# Altium schematic sheet Placa_Motor_Esquematico_v2.SchDoc
size A3
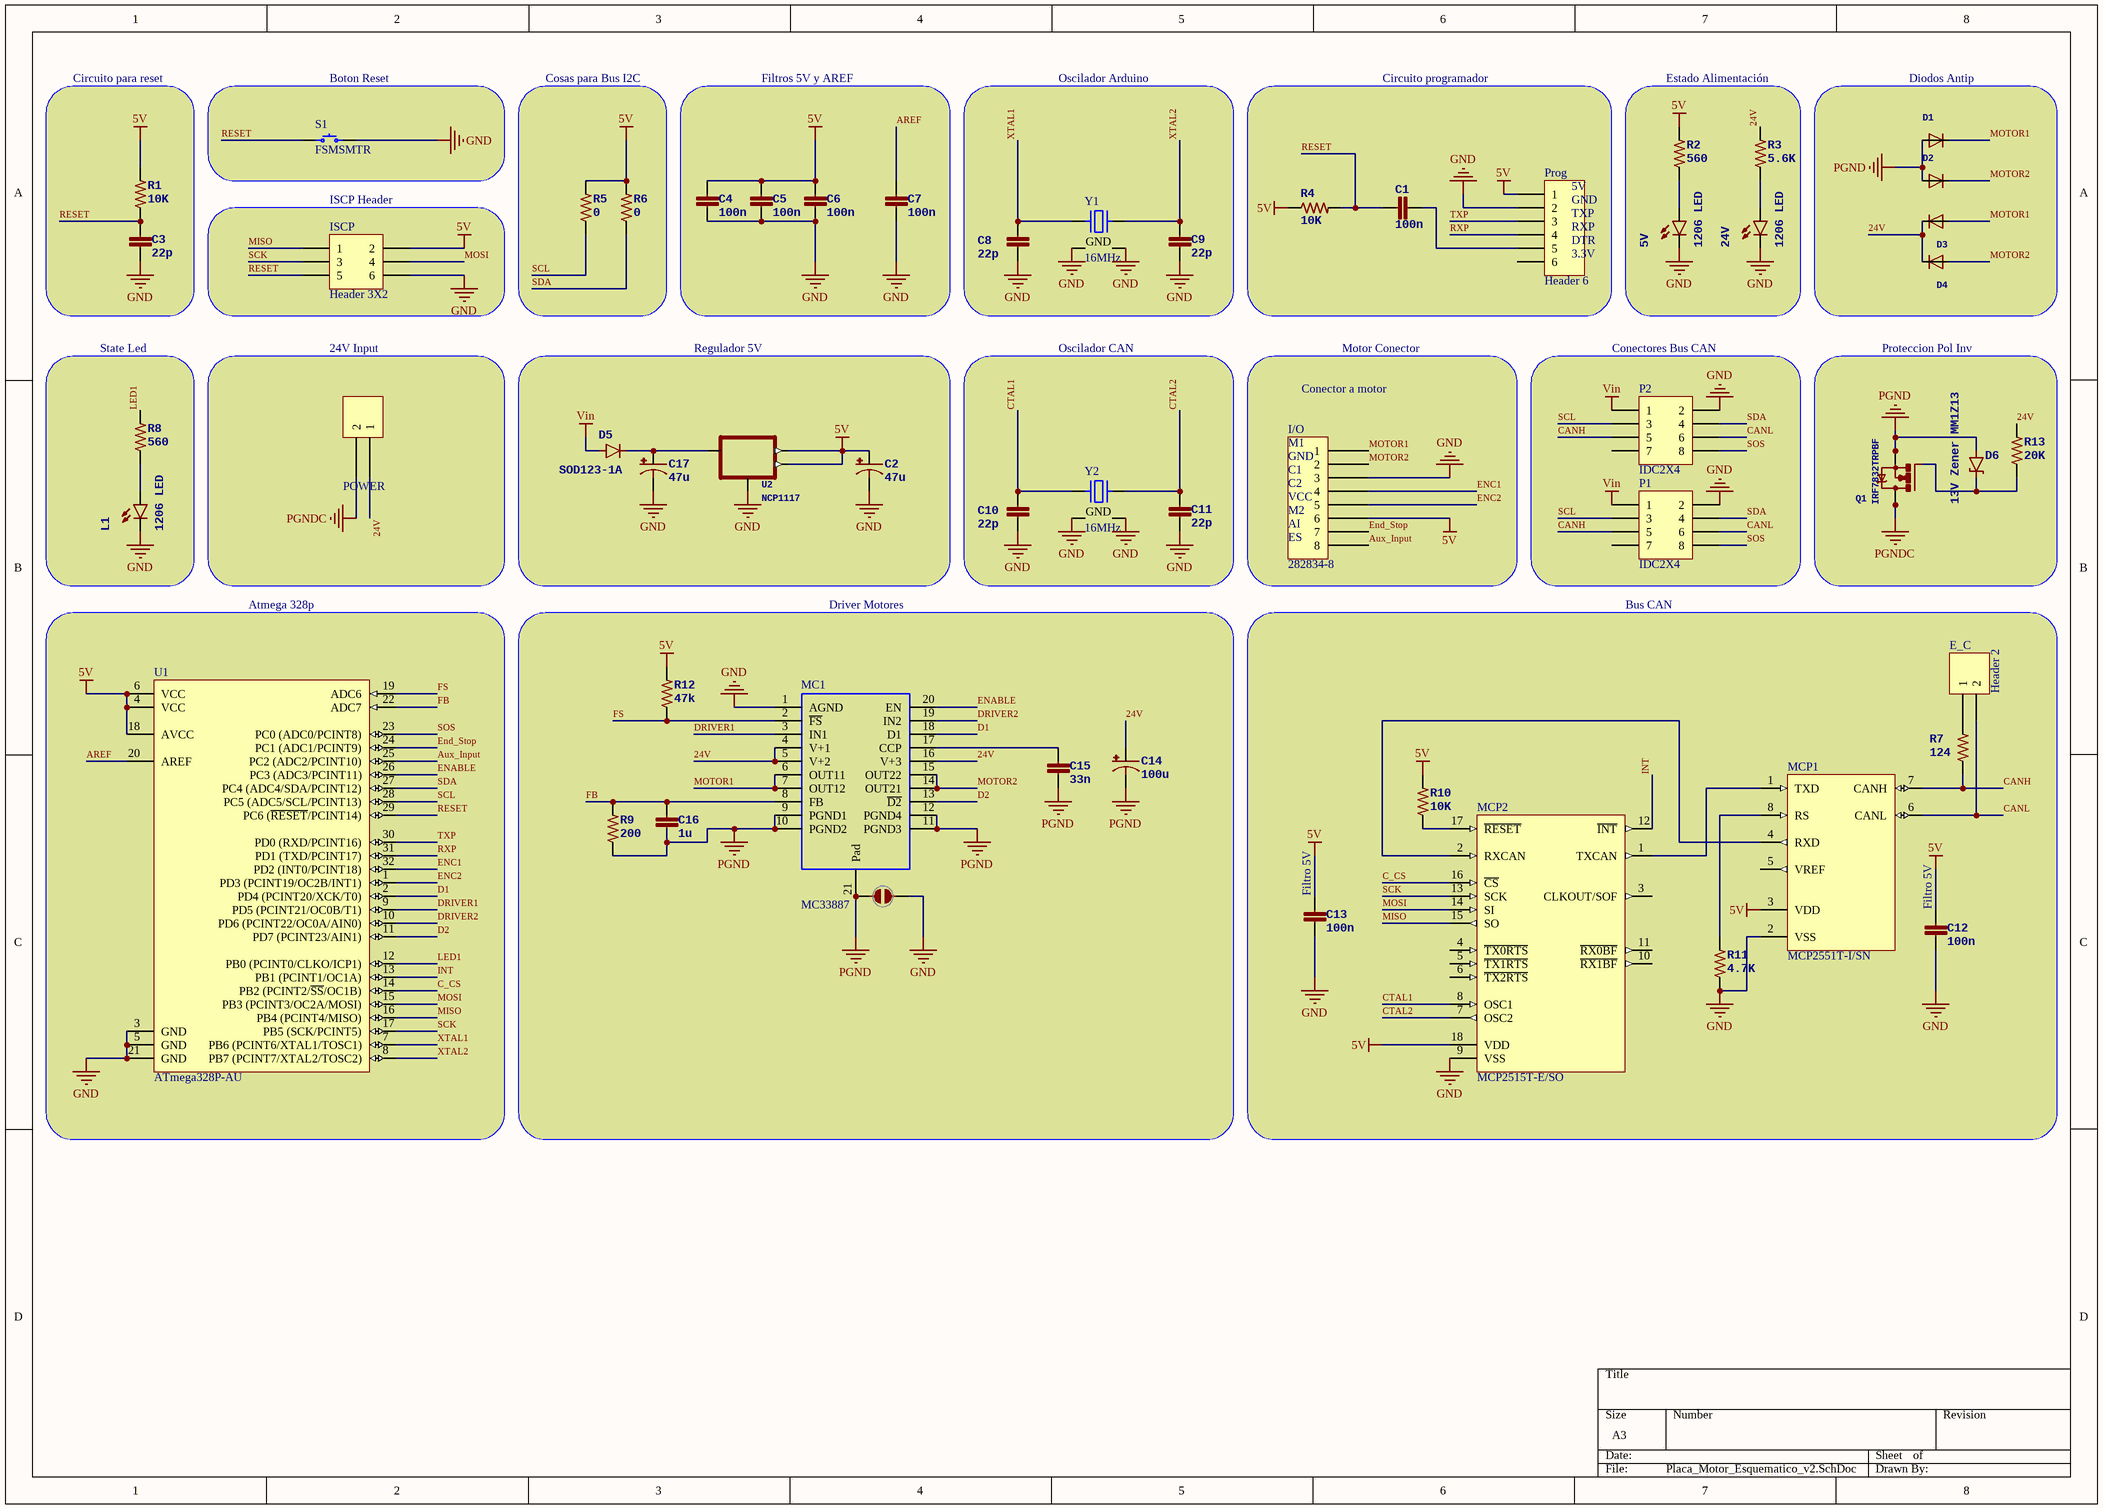
[diagram p0: Placa_Motor_Esquematico_v2.SchDoc]

## Parts
5V  1206 LED  [LED-1206]
24V  1206 LED  [LED-1206]
C1  100n  [0805]
C2  47u  [PANASONIC_D]
C3  22p  [0805]
C4  100n  [0805]
C5  100n  [0805]
C6  100n  [0805]
C7  100n  [0805]
C8  22p  [0805]
C9  22p  [0805]
C10  22p  [0805]
C11  22p  [0805]
C12  100n  [0805]
C13  100n  [0805]
C14  100u  [PANASONIC_D]
C15  33n  [0805]
C16  1u  [0805]
C17  47u  [PANASONIC_D]
D1  SBR3U40P1-7  [POWERDI-123]  (value not drawn)
D2  SBR3U40P1-7  [POWERDI-123]  (value not drawn)
D3  SBR3U40P1-7  [POWERDI-123]  (value not drawn)
D4  SBR3U40P1-7  [POWERDI-123]  (value not drawn)
D5  SOD123-1A  [SOD-123]
D6  13V Zener MM1Z13  [SOD-123]
E_C  Header 2  [HDR1X2]
I/O  282834-8  [TE 282834-8]
ISCP  Header 3X2  [HDR2X3]
JP?  JUMPER-PAD-2-NC_BY_PASTE  [PAD-JUMPER-2-NC_BY_PASTE_YES_SILK]  (value not drawn)
L1  1206 LED  [LED-1206]
MC1  MC33887  [SOIC127P1420X340-21N]
MCP1  MCP2551T-I/SN  [SOIC-SN8_N]
MCP2  MCP2515T-E/SO  [SOIC-SO18_N]
P1  IDC2X4  [IDC2X4]
P2  IDC2X4  [IDC2X4]
POWER  20020110-D021A01LF  [FCI 06-381-2PIN]  (value not drawn)
Prog  Header 6  [HDR1X6]
Q1  IRF7832TRPBF  [SO-08]
R1  10K  [0805]
R2  560  [0805]
R3  5.6K  [0805]
R4  10K  [0805]
R5  0  [0805]
R6  0  [0805]
R7  124  [0805]
R8  560  [0805]
R9  200  [0805]
R10  10K  [0805]
R11  4.7K  [0805]
R12  47k  [0805]
R13  20K  [0805]
S1  FSMSMTR  [TE FSMSMTR]
U1  ATmega328P-AU  [32A_N]
U2  NCP1117  [SOT223]
Y1  16MHz  [NDK NX3225SA]
Y2  16MHz  [NDK NX3225SA]

## Blocks framed on the sheet
Circuito para reset: C3 R1
Boton Reset: S1
Cosas para Bus I2C: R5 R6
Filtros 5V y AREF: C4-C7
Oscilador Arduino: C8 C9 Y1
Estado Alimentación: 5V 24V R2 R3
Diodos Antip: D1-D4
ISCP Header: ISCP
State Led: L1 R8
24V Input: POWER
Regulador 5V: C2 C17 D5 U2
Oscilador CAN: C10 C11 Y2
Conectores Bus CAN: P1 P2
Proteccion Pol Inv: D6 Q1 R13
Atmega 328p: U1
Driver Motores: C14-C16 JP? MC1 R9 R12

## Nets
5V: C2.+ C4.1 C5.1 C6.1 C12.1 C13.1 I/O.6 ISCP.2 MCP1.3(VDD) MCP2.18(VDD) Prog.1 R1.2 R2.2 R4.1 R5.2 R6.2 R10.2 R12.2 U1.4(VCC) U1.6(VCC) U1.18(AVCC) U2.2(OUT) U2.4(OUT@1)
GND: 5V.C 24V.C C2.- C3.2 C4.2 C5.2 C6.2 C7.2 C8.2 C9.2 C10.2 C11.2 C12.2 C13.2 C17.- I/O.3 ISCP.6 JP?.2 L1.C MC1.1(AGND) MCP1.2(VSS) MCP2.9(VSS) P1.2 P2.2 Prog.2 R11.1 S1.2 U1.3(GND) U1.5(GND) U1.21(GND) U2.1(ADJ) Y1.2(GND) Y1.4(GND) Y2.2(GND) Y2.4(GND)
PGND: C14.- C15.2 C16.2 D1.A D2.A D6.A JP?.1 MC1.9(PGND1) MC1.10(PGND2) MC1.11(PGND3) MC1.12(PGND4) MC1.21(Pad) Q1.1(S) Q1.2(S) Q1.3(S) R9.1
PGNDC: POWER.2 Q1.5(D) Q1.6(D) Q1.7(D) Q1.8(D)
Vin: D5.A P1.1 P2.1
24V: C14.+ D3.C D4.C MC1.4(V+1) MC1.5(V+2) MC1.16(V+3) POWER.1 R3.2 R13.2
AREF: C7.1 U1.20(AREF)
Aux_Input: I/O.8 U1.25(PC2_(ADC2/PCINT10))
C_CS: MCP2.16(~{CS}) U1.14(PB2_(PCINT2/~{SS}/OC1B))
CANH: MCP1.7(CANH) P1.5 P2.5 R7.1
CANL: E_C.2 MCP1.6(CANL) P1.6 P2.6
CTAL1: C10.1 MCP2.8(OSC1) Y2.1
CTAL2: C11.1 MCP2.7(OSC2) Y2.3
D1: MC1.18(D1) U1.2(PD4_(PCINT20/XCK/T0))
D2: MC1.13(~{D2}) U1.11(PD7_(PCINT23/AIN1))
DRIVER1: MC1.3(IN1) U1.9(PD5_(PCINT21/OC0B/T1))
DRIVER2: MC1.19(IN2) U1.10(PD6_(PCINT22/OC0A/AIN0))
ENABLE: MC1.20(EN) U1.26(PC3_(ADC3/PCINT11))
ENC1: I/O.4 U1.32(PD2_(INT0/PCINT18))
ENC2: I/O.5 U1.1(PD3_(PCINT19/OC2B/INT1))
End_Stop: I/O.7 U1.24(PC1_(ADC1/PCINT9))
FB: C16.1 MC1.8(FB) R9.2 U1.22(ADC7)
FS: MC1.2(~{FS}) R12.1 U1.19(ADC6)
INT: MCP2.12(~{INT}) U1.13(PB1_(PCINT1/OC1A))
LED1: R8.2 U1.12(PB0_(PCINT0/CLKO/ICP1))
MISO: ISCP.1 MCP2.15(SO) U1.16(PB4_(PCINT4/MISO))
MOSI: ISCP.4 MCP2.14(SI) U1.15(PB3_(PCINT3/OC2A/MOSI))
MOTOR1: D1.C D3.A I/O.1 MC1.6(OUT11) MC1.7(OUT12)
MOTOR2: D2.C D4.A I/O.2 MC1.14(OUT21) MC1.15(OUT22)
RESET: C1.1 C3.1 ISCP.5 R1.1 R4.2 S1.1 U1.29(PC6_(~{RESET}/PCINT14))
RXP: Prog.4 U1.31(PD1_(TXD/PCINT17))
SCK: ISCP.3 MCP2.13(SCK) U1.17(PB5_(SCK/PCINT5))
SCL: P1.3 P2.3 R5.1 U1.28(PC5_(ADC5/SCL/PCINT13))
SDA: P1.4 P2.4 R6.1 U1.27(PC4_(ADC4/SDA/PCINT12))
SOS: P1.8 P2.8 U1.23(PC0_(ADC0/PCINT8))
TXP: Prog.3 U1.30(PD0_(RXD/PCINT16))
XTAL1: C8.1 U1.7(PB6_(PCINT6/XTAL1/TOSC1)) Y1.1
XTAL2: C9.1 U1.8(PB7_(PCINT7/XTAL2/TOSC2)) Y1.3
Net5V_A: 5V.A R2.1
Net24V_A: 24V.A R3.1
NetC1_2: C1.2 Prog.5
NetC15_1: C15.1 MC1.17(CCP)
NetC17_+: C17.+ D5.C U2.3(IN)
NetD6_C: D6.C Q1.4(G) R13.1
NetE_C_1: E_C.1 R7.2
NetL1_A: L1.A R8.1
NetMCP1_1: MCP1.1(TXD) MCP2.1(TXCAN)
NetMCP1_4: MCP1.4(RXD) MCP2.2(RXCAN)
NetMCP1_8: MCP1.8(RS) R11.2
NetMCP2_17: MCP2.17(~{RESET}) R10.1

Not connected (* = marked no-connect by the designer): MCP1 5(VREF); MCP2 3(CLKOUT/SOF) 4(~{TX0RTS}) 5(~{TX1RTS}) 6(~{TX2RTS}) 10(~{RX1BF}) 11(~{RX0BF}); P1 7; P2 7; Prog 6

## Notes on the sheet
- Circuito programador
- (near Prog) 5V
- (near Prog) GND
- (near Prog) TXP
- (near Prog) RXP
- (near Prog) DTR
- (near Prog) 3.3V
- Motor Conector
- (near I/O) M1
- Conector a motor
- (near I/O) GND
- (near I/O) C1
- (near I/O) C2
- (near I/O) VCC
- (near I/O) M2
- (near I/O) AI
- (near I/O) ES
- Bus CAN
- (near C13) Filtro 5V
- (near C12) Filtro 5V

## Library data of the parts
5V 24V L1 = LED1206
C1 C3-C13 C15 C16 = CAP0805
C2 C14 C17 = 47UF-50V-20%(ELECT): PROD_ID: CAP-10547
  C14: Size: 6.3mm
D1-D4 = DFLS1100-7
D5 = DIODESOD123
D6 = DIODE-ZENER16V: PROD_ID: DIO-12440
E_C = Header 2: Header, 2-Pin; LatestRevisionDate: 17-Jul-2002; LatestRevisionNote: Re-released for DXP Platform.; Publisher: Altium Limited
I/O = 282834-8: TERM BLOCK 8POS SIDE ENT 2.54MM; Manufacturer: TE Connectivity AMP Connectors; TemperatureRange: -40C ~ 105C; Voltage: 150V; Pitch: 0.100" (2.54mm); Number Of Levels: 1; Positions Per Level: 8; Part Number: 282834-8; PartId: 9295; Supplier 1: Digi-Key; Supplier Part Number 1: A98338-ND; ComponentLink1Description: Datasheet; ComponentLink1URL: http://www.te.com/commerce/DocumentDelivery/DDEController?Action=srchrtrv&DocNm=282834&DocType=Customer+Drawing&DocLang=English; ComponentLink2Description: Digi-Key Listing; ComponentLink2URL: http://www.digikey.ca/product-detail/en/282834-8/A98338-ND/1150136; Price: 8,41; Colour: Green; Orientation: Horizontal with Board
ISCP = Header 3X2: Header, 3-Pin, Dual row; LatestRevisionDate: 17-Jul-2002; LatestRevisionNote: Re-released for DXP Platform.; Publisher: Altium Limited
MC1 = MC33887: Motor / Motion / Ignition Controllers & Drivers 5.0 A H-BRIDGE; Manufacturer_Name: NXP; Geometry.Height: 3.4mm; Manufacturer_Part_Number: MC33887; RS Part Number: *; RS Price/Stock: *; Arrow Part Number: MC33887; Arrow Price/Stock: *; Datasheet Link: https://www.nxp.com/docs/en/data-sheet/MC33887.pdf
MCP1 = MCP2551T-I/SN: High-Speed CAN Transceiver, 8-Pin SOIC, Industrial Temperature, Tape and Reel; Published: 29-Jan-2009; DatasheetVersion: revE, Jan-2007; PackageVersion: revBB, Aug-2009; PackageReference: SOIC-SN8; Publisher: Altium Limited; PackageDescription: 8-Lead Plastic Small Outline (SN) - Narrow, 3.90mm Body [SOIC]; Supplier 1: Digi-Key; Supplier Part Number 1: MCP2551T-I/SNTR-ND; Supplier 2: Farnell; Supplier Part Number 2: 1788569; Code_JEDEC: MS-012; Code_IPC: SOIC127P600-8; ComponentLink1Description: Datasheet; ComponentLink1URL: http://ww1.microchip.com/downloads/en/DeviceDoc/21667E.pdf; ComponentLink2Description: Packaging Specification; ComponentLink2URL: http://www.microchip.com/stellent/groups/techpub_sg/documents/packagingspec/en012702.pdf; ComponentLink3Description: Microchip.com Home; ComponentLink3URL: http://www.microchip.com/
MCP2 = MCP2515T-E/SO: Stand-Alone CAN Controller With SPI Interface, 18-Pin SOIC, Extended Temperature, Tape and Reel; Published: 29-Jan-2009; DatasheetVersion: revE, Nov-2007; PackageVersion: revBB, Aug-2009; PackageReference: SOIC-SO18; Publisher: Altium Limited; PackageDescription: 18-Lead Plastic Small Outline (SO) - Wide 7.50mm Body [SOIC]; Supplier 1: Digi-Key; Supplier Part Number 1: MCP2515T-E/SO-ND; Code_JEDEC: MS-013; ComponentLink1Description: Datasheet; ComponentLink1URL: http://ww1.microchip.com/downloads/en/DeviceDoc/21801e.pdf; ComponentLink2Description: Packaging Specification; ComponentLink2URL: http://www.microchip.com/stellent/groups/techpub_sg/documents/packagingspec/en012702.pdf; ComponentLink3Description: Microchip.com Home; ComponentLink3URL: http://www.microchip.com/
P1 P2 = IDC2X4: Header, 4-Pin, Dual row; LatestRevisionDate: 17-Jul-2002; LatestRevisionNote: Re-released for DXP Platform.; Publisher: Altium Limited
POWER = 20020110-D021A01LF: TERM BLOCK HDR 2POS R/A 3.81MM; Manufacturer: FCI; TemperatureRange: -40C ~ 115C; Voltage: 300V; Pitch: 0.150" (3.81mm); Number Of Positions: 2; Number Of Levels: 1; Part Number: 20020110-D021A01LF; PartId: 7785; Supplier 1: Digi-Key; Supplier Part Number 1: 609-3819-ND; ComponentLink1Description: Datasheet; ComponentLink1URL: http://portal.fciconnect.com/Comergent//fci/drawing/20020110.pdf; ComponentLink2Description: Digi-Key Listing; ComponentLink2URL: http://www.digikey.ca/product-detail/en/20020110-D021A01LF/609-3819-ND/2261255; Price: 0,75; Type: Through Hole; Colour: Green; Orientation: 90, Right Angle; Positions Per Level: 2
Prog = Header 6: Header, 6-Pin; LatestRevisionDate: 17-Jul-2002; LatestRevisionNote: Re-released for DXP Platform.; Publisher: Altium Limited
Q1 = N-MOSFET-SO8S
R1-R13 = RESISTOR0805-RES
S1 = FSMSMTR: SWITCH TACTILE SPST-NO 0.05A 24V; Manufacturer: TE Connectivity Alcoswitch Switches; Switch Function: Off-Mom; Contact Rating @ Voltage: 0.05A @ 24VDC; Actuator Type: Standard; Actuator Orientation: Top Actuated; Illumination: Non-Illuminated; Operating Force: 180gf; Switch Travel: 0.25mm; Mechanical Life: 20,000 Cycles; Part Number: FSMSMTR; PartId: 8251; Supplier 1: Digi-Key; Supplier Part Number 1: 450-1758-2-ND; ComponentLink1Description: Datasheet; ComponentLink1URL: http://www.te.com/commerce/DocumentDelivery/DDEController?Action=srchrtrv&DocNm=1437566-3&DocType=Customer+Drawing&DocLang=English; ComponentLink2Description: Digi-Key Listing; ComponentLink2URL: http://www.digikey.com/product-detail/en/FSMSMTR/450-1758-2-ND/529671; Price: 0,175; Circuit: SPST-NO; Illumination Voltage: -; Illumination Type, Colour: -; Operating Temperature: -35C ~ 85C
U1 = ATmega328P-AU: 8-bit AVR Microcontroller, 32KB Flash, 1KB EEPROM, 2KB SRAM, 32-pin TQFP, Industrial Grade (-40°C to 85°C); Published: 1-Apr-2010; DatasheetVersion: revA, Jan-2010; PackageVersion: revB, Oct-2001; PackageReference: 32A; Publisher: Altium Limited; PackageDescription: 32-Lead, 7x7x1.0 mm Body, 0.8mm Lead Pitch, Thin Profile Plastic Quad Flat Package (TQFP); Supplier 1: Digi-Key; Supplier Part Number 1: ATMEGA328P-AU-ND; Supplier 2: Farnell; Supplier Part Number 2: 1715486; Supplier 3: Mouser; Supplier Part Number 3: 556-ATMEGA328P-AU; Code_JEDEC: MS-026-ABA; ComponentLink1Description: Manufacturer Link; ComponentLink1URL: http://www.atmel.com/products/avr/default.asp?; ComponentLink2Description: ATmega48A/48PA/88A/88PA/168A/168PA/328/328P Datasheet; ComponentLink2URL: http://www.atmel.com/dyn/resources/prod_documents/8271.pdf; ComponentLink3Description: ATmega48A/48PA/88A/88PA/168A/168PA/328/328P Summary; ComponentLink3URL: http://www.atmel.com/dyn/resources/prod_documents/8271S.pdf; ComponentLink4Description: Atmel.com Home; ComponentLink4URL: http://www.atmel.com
U2 = V_REG_LM1117SOT223: PROD_ID: VREG-08170
Y1 Y2 = NX3225SA-16.000MHZ-STD-CSR-1: CRYSTAL 16.0000MHZ 8PF SMD; Manufacturer: NDK; Frequency Stability: 15ppm; ESR: 80 Ohm; Operating Mode: Fundamental; Part Number: NX3225SA-16.000MHZ-STD-CSR-1; PartId: 8509; Supplier 1: Digi-Key; Supplier Part Number 1: 644-1049-2-ND; ComponentLink1Description: Datasheet; ComponentLink1URL: http://media.digikey.com/pdf/Data%20Sheets/NDK%20PDFs/NX3225SA.pdf; ComponentLink2Description: Digi-Key Listing; ComponentLink2URL: http://www.digikey.com/product-detail/en/NX3225SA-16.000MHZ-STD-CSR-1/644-1049-2-ND/1128831; Price: 0,3799; Type: MHz Crystal; Device Package: 4-SMD, No Lead (DFN, LCC); Frequency: 16MHz; Frequency Tolerance: 15ppm; Load Capacitance: 8pF